# EAGLE design AS7265X.v02c (EAGLE 7.7.0)
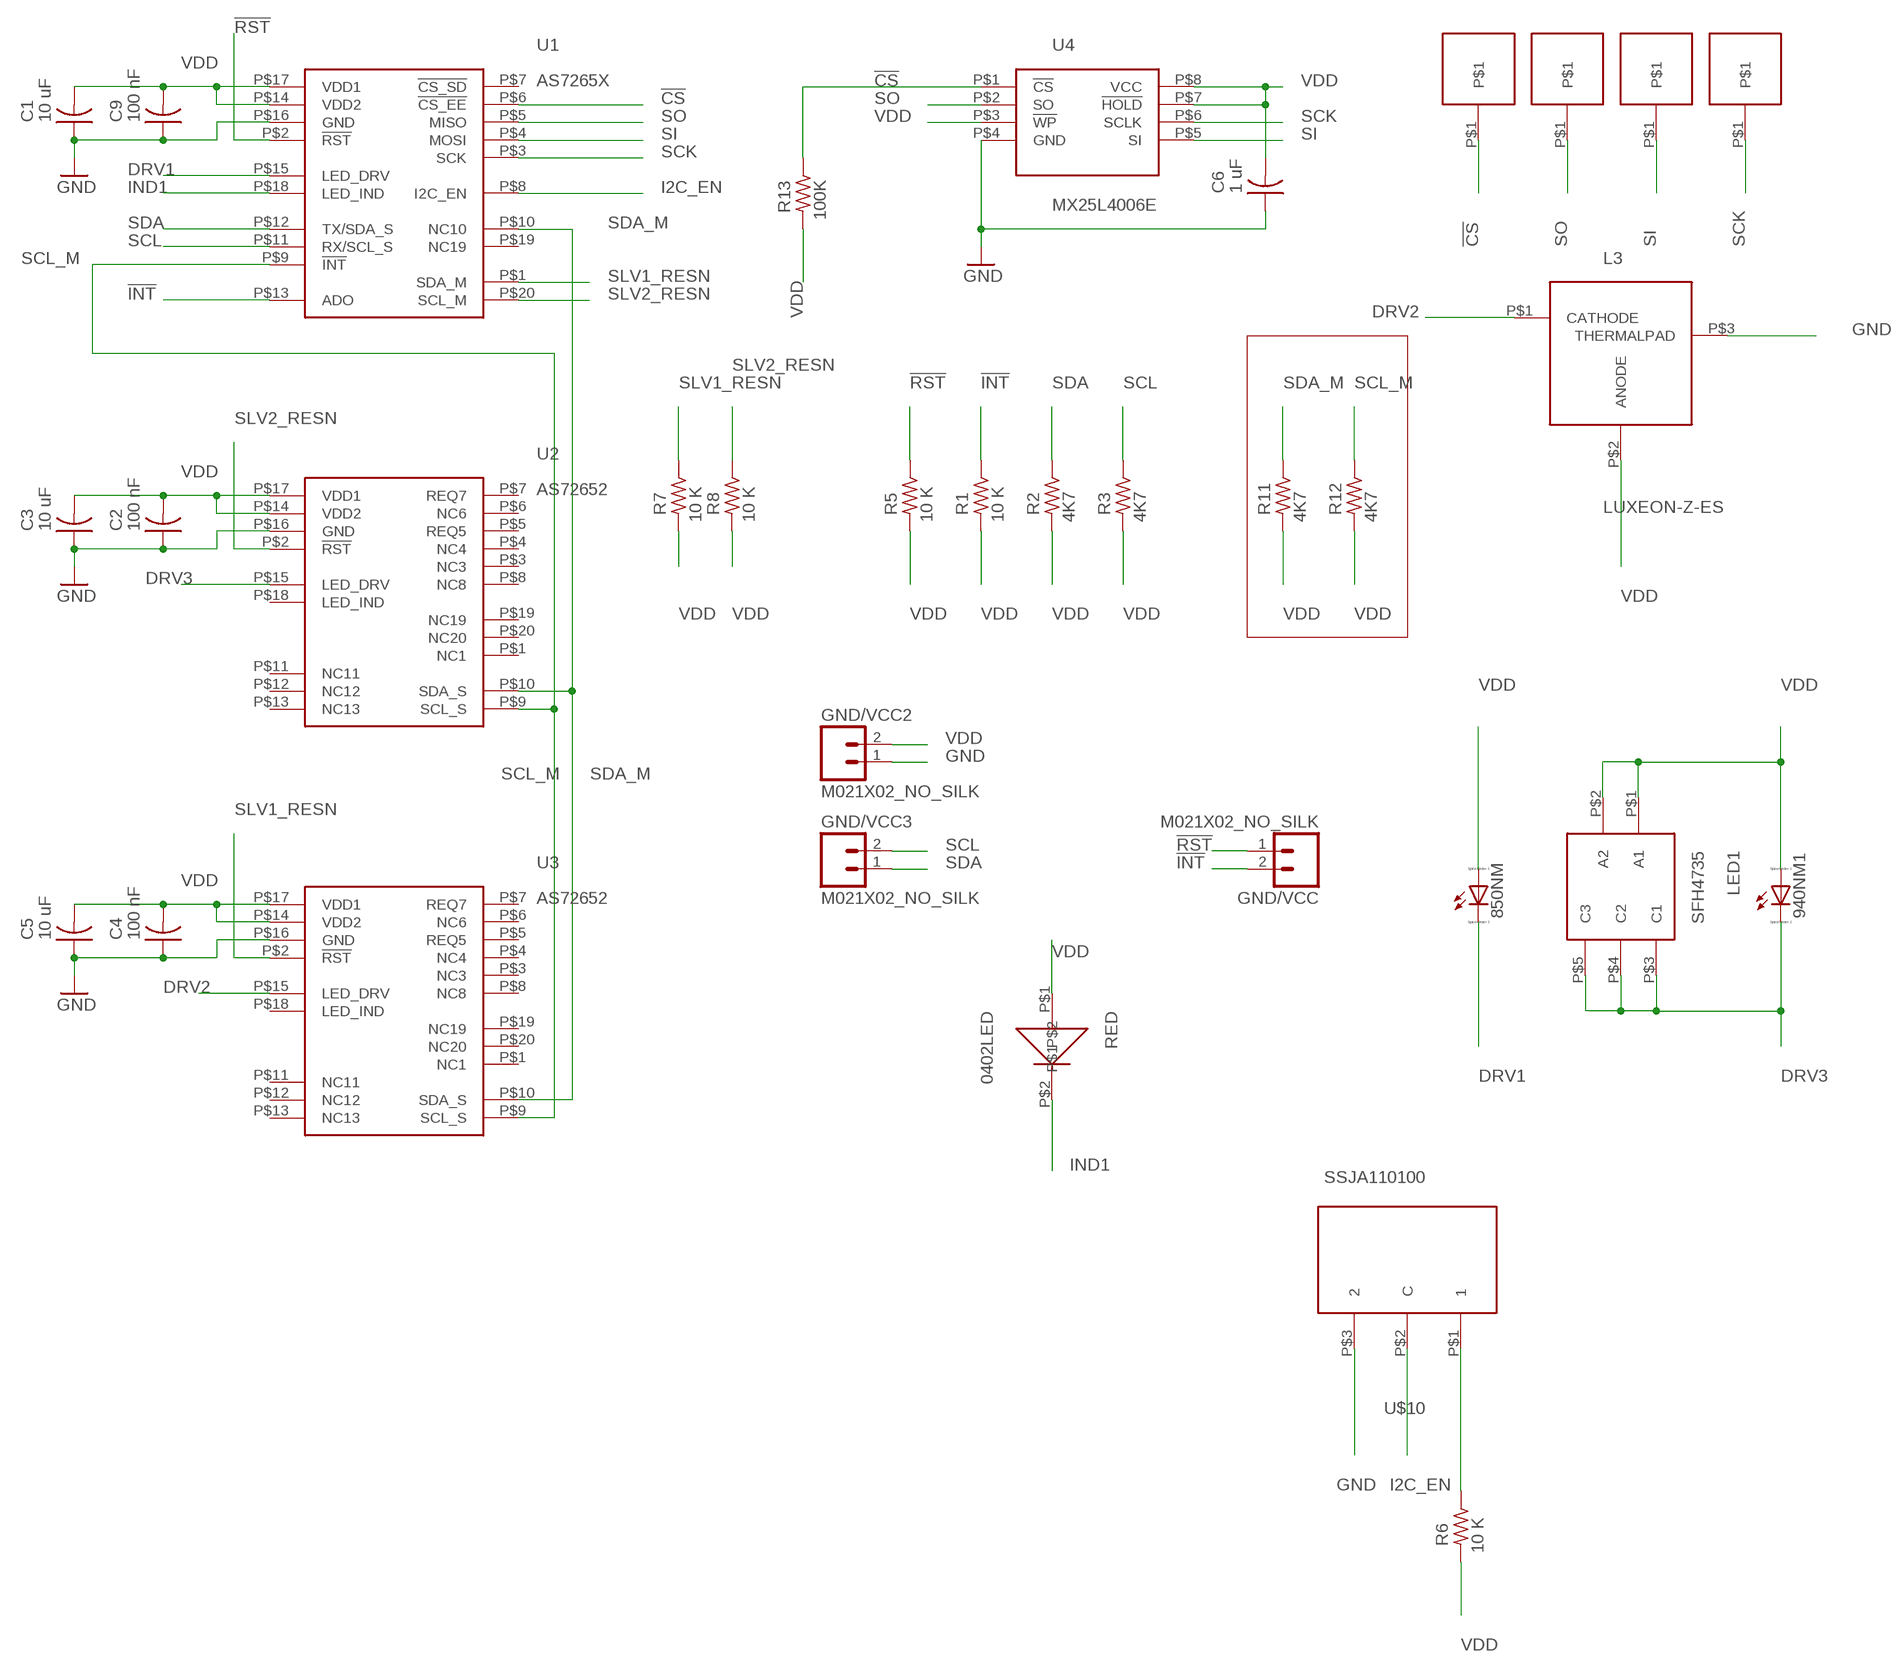
[diagram p0: schematic, sheet 1]

## Parts
850NM  LED_ESML0603  [LED_SML0603]
940NM1  LED_ESML0603  [LED_SML0603]
C1  10 uF  C-US  [C0402_B]
C2  100 nF  C-US  [C0402_B]
C3  10 uF  C-US  [C0402_B]
C4  100 nF  C-US  [C0402_B]
C5  10 uF  C-US  [C0402_B]
C6  1 uF  C-US  [C0402_B]
C9  100 nF  C-US  [C0402_B]
GND/VCC  M021X02_NO_SILK  [1X02_NO_SILK]
GND/VCC2  M021X02_NO_SILK  [1X02_NO_SILK]
GND/VCC3  M021X02_NO_SILK  [1X02_NO_SILK]
L3  LUXEON-Z-ES  [LUXEON-Z-ES]
LED1  SFH4735  [SFH4735]
R1  10 K  R-US_  [R0402_B]
R2  4K7  R-US_  [R0402_B]
R3  4K7  R-US_  [R0402_B]
R5  10 K  R-US_  [R0402_B]
R6  10 K  R-US_  [R0402_B]
R7  10 K  R-US_  [R0402_B]
R8  10 K  R-US_  [R0402_B]
R11  4K7  R-US_  [R0402_B]
R12  4K7  R-US_  [R0402_B]
R13  100K  R-US_  [R0402_B]
RED  0402LED  [0402LED]
U1  AS7265X  [AS7265X]
U2  AS72652  [AS7265X]
U3  AS72652  [AS7265X]
U4  MX25L4006E  [USON-8]
U$1  HN01  [HN01]
U$2  HN01  [HN01]
U$7  HN01  [HN01]
U$8  HN01  [HN01]
U$10  SSJA110100  [SSAJ110100]

## Nets
!CS: R13.1 U1.P$6(!CS_EE) U4.P$1(!CS) U$7.P$1
!INT: GND/VCC.2 R1.1 U1.P$13(ADO)
!RST: GND/VCC.1 R5.1 U1.P$2(!RST)
DRV1: 850NM.C U1.P$15(LED_DRV)
DRV2: L3.P$1(CATHODE) U3.P$15(LED_DRV)
DRV3: 940NM1.C LED1.P$3(C1) LED1.P$4(C2) LED1.P$5(C3) U2.P$15(LED_DRV)
GND: C1.1 C2.1 C3.1 C4.1 C5.1 C6.1 C9.1 GND/VCC2.1 L3.P$3(THERMALPAD) U1.P$16(GND) U2.P$16(GND) U3.P$16(GND) U4.P$4(GND) U$10.P$3
I2C_EN: U1.P$8(I2C_EN) U$10.P$2(C)
IND1: RED.P$2 U1.P$18(LED_IND)
N$1: R6.1 U$10.P$1
SCK: U1.P$3(SCK) U4.P$6(SCLK) U$2.P$1
SCL: GND/VCC3.2 R3.1 U1.P$11(RX/SCL_S)
SCL_M: R12.1 U1.P$9(!INT) U2.P$9(SCL_S) U3.P$9(SCL_S)
SDA: GND/VCC3.1 R2.1 U1.P$12(TX/SDA_S)
SDA_M: R11.1 U1.P$10(NC10) U2.P$10(SDA_S) U3.P$10(SDA_S)
SI: U1.P$4(MOSI) U4.P$5(SI) U$1.P$1
SLV1_RESN: R7.1 U1.P$1(SDA_M) U3.P$2(!RST)
SLV2_RESN: R8.1 U1.P$20(SCL_M) U2.P$2(!RST)
SO: U1.P$5(MISO) U4.P$2(SO) U$8.P$1
VDD: 850NM.A 940NM1.A C1.2 C2.2 C3.2 C4.2 C5.2 C6.2 C9.2 GND/VCC2.2 L3.P$2(ANODE) LED1.P$1(A1) LED1.P$2(A2) R1.2 R2.2 R3.2 R5.2 R6.2 R7.2 R8.2 R11.2 R12.2 R13.2 RED.P$1 U1.P$14(VDD2) U1.P$17(VDD1) U2.P$14(VDD2) U2.P$17(VDD1) U3.P$14(VDD2) U3.P$17(VDD1) U4.P$3(!WP) U4.P$7(!HOLD) U4.P$8(VCC)
Unconnected: U1.P$7(!CS_SD) U1.P$19(NC19) U2.P$1(NC1) U2.P$3(NC3) U2.P$4(NC4) U2.P$5(REQ5) U2.P$6(NC6) U2.P$7(REQ7) U2.P$8(NC8) U2.P$11(NC11) U2.P$12(NC12) U2.P$13(NC13) U2.P$18(LED_IND) U2.P$19(NC19) U2.P$20(NC20) U3.P$1(NC1) U3.P$3(NC3) U3.P$4(NC4) U3.P$5(REQ5) U3.P$6(NC6) U3.P$7(REQ7) U3.P$8(NC8) U3.P$11(NC11) U3.P$12(NC12) U3.P$13(NC13) U3.P$18(LED_IND) U3.P$19(NC19) U3.P$20(NC20)

## Library data of the parts
850NM 940NM1 = eagle-ltspice:LED_E: LED Source: http://www.osram.convergy.de Source: www.luxeon.com Source: www.kingbright.com; SPICEMODEL: NONE; SPICEPREFIX: D; SPICETYPE: diode
C1-C6 C9 = Spark:C-US: Capacitor
GND/VCC GND/VCC2 GND/VCC3 = SparkFun-Connectors:M02: Standard 2-pin 0.1" header. Use with - straight break away headers ( PRT-00116) - right angle break away headers (PRT-00553) - swiss pins (PRT-00743) - machine pins (PRT-00117) - female headers (PRT-00115) Molex polarized connector foot print use with: PRT-08233 with associated crimp pins and housings. 2.54_SCREWTERM for use with PRT-10571. 3.5mm Screw Terminal footprints for PRT-08084 5mm Screw Terminal footprints for use with PRT-08433
L3 = kris:LUXEON-Z-ES: Luxeon Z ES flash LED by Phillips
LED1 = kris:SFH4735: SFH4735 Broad-band iR led
R1-R3 R5-R8 R11-R13 = Spark:R-US_: 0402 Resistor
RED = kris:0402LED: 0402led
U1 = kris:AS7265X: AS7265X AMG Smart Spectral Sensor http://ams.com/eng/Products/Spectral-Sensing/Multi-spectral-Sensing/AS7265x
U2 U3 = kris:AS72652: AS72652/3
U4 = kris:MX25L4006E: uson-8 package for Macronix MX25L4006E 4 Mbit SPI Fash
U$1 U$2 U$7 U$8 = PWSONN6:HN01
U$10 = kris:SSJA110100: ALPS SSJA110100 SPDT slide switch with lugs

## Board
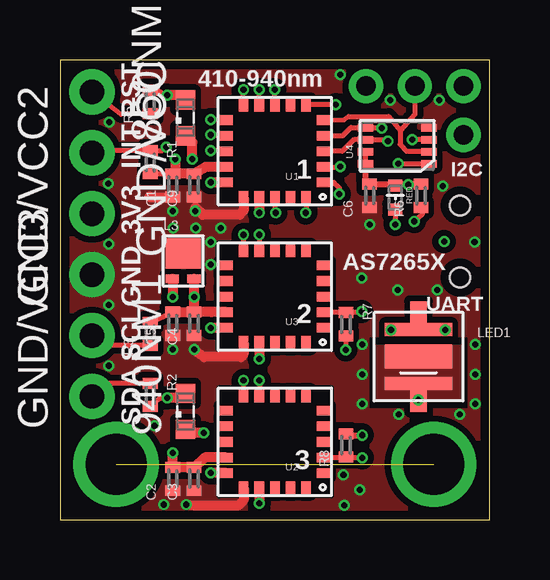
[diagram p1: board, top side]
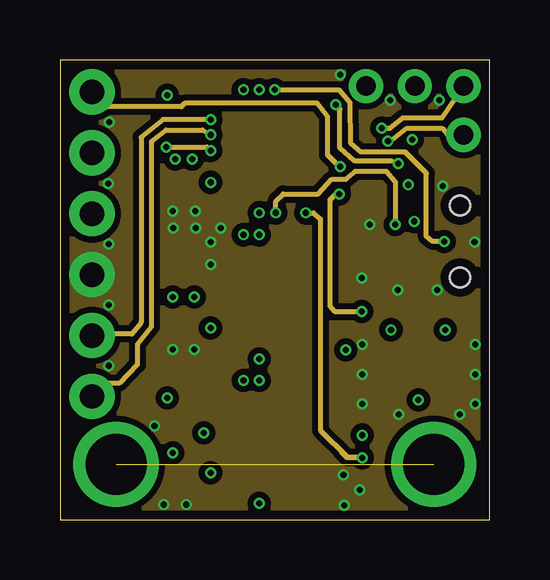
[diagram p2: board, inner layer Route2]
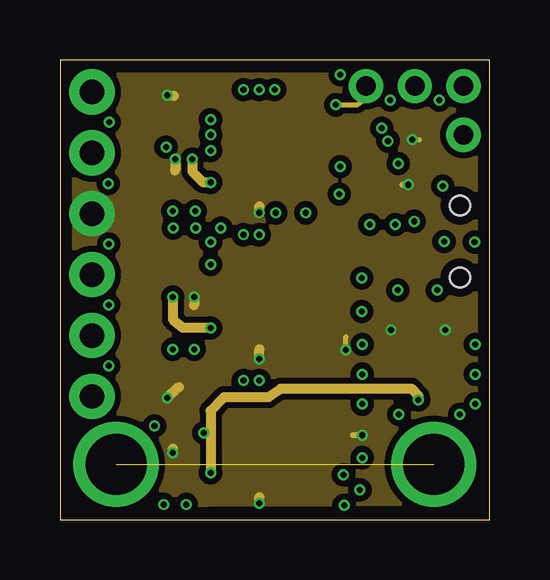
[diagram p3: board, inner layer Route15]
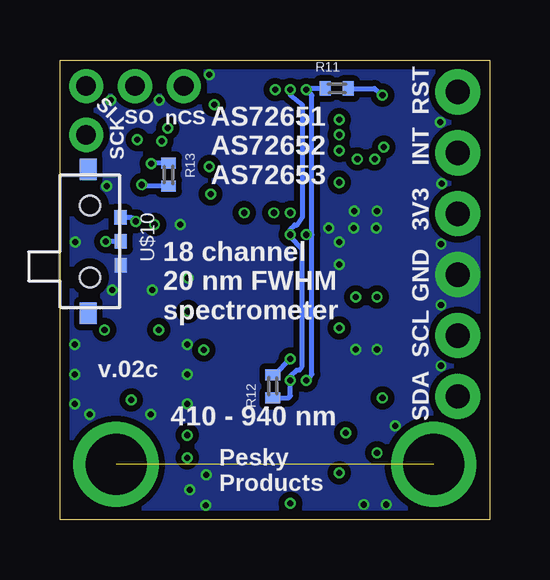
[diagram p4: board, bottom side, seen from below]

Size 17.91 x 19.18 mm. Coordinates in mm from the lower left corner, seen from the top.
Outline: 0,0 17.91,0 17.91,19.18 0,19.18 0,0
Copper layers (1*2*15*16): Top 0.035559375mm / dielectric 0.17018125mm / Route2 0.01778125mm / dielectric 47mil / Route15 0.01778125mm / dielectric 0.17018125mm / Bottom 0.035559375mm
Design rules "oshpark-4layer *": minimum track width 5mil, minimum drill 10mil, track to track 5mil, track to pad 5mil, pad to pad 5mil, via to via 5mil, smd to smd 5mil, copper to edge 15mil, drill to drill 6mil, minimum pad ring 4mil, minimum via ring 4mil, stop-mask expansion 2.5mil, vias tented up to drill 20mil, thermal gap 10mil

### Footprints (pad centres in the part's own frame; a part is rotated, then mirrored left to right if it is on the bottom)
LED_SML0603 = smd 0.8 x 0.8: A 0.75,0; C -0.75,0
C0402_B = smd 0.457 x 0.61: 1 -0.483,0; 2 0.483,0
1X02_NO_SILK = drill 1.016 pad 1.88: 1 0,0; 2 2.54,0
LUXEON-Z-ES = smd 0.55 x 0.35: P$1 -0.45,-0.745; P$2 0.45,-0.745 | smd 1.45 x 1.25: P$3 0,0.315
SFH4735 = smd 2.8 x 0.55: P$1 0,1.125; P$4 0,-1.125 | smd 0.7 x 0.9: P$2 0,1.85; P$5 0,-1.85 | smd 2.8 x 1: P$3 0,0
R0402_B = smd 0.457 x 0.61: 1 -0.483,0; 2 0.483,0
0402LED = smd 0.5 x 0.6: P$1 -0.5,0; P$2 0.5,0
AS7265X = smd 0.55 x 0.4: P$1 -2.025,1.3; P$2 -2.025,0.65; P$3 -2.025,0; P$4 -2.025,-0.65; P$5 -2.025,-1.3; P$11 2.025,-1.3; P$12 2.025,-0.65; P$13 2.025,0; P$14 2.025,0.65; P$15 2.025,1.3 | smd 0.4 x 0.55: P$6 -1.3,-1.925; P$7 -0.65,-1.925; P$8 0,-1.925; P$9 0.65,-1.925; P$10 1.3,-1.925; P$16 1.3,1.925; P$17 0.65,1.925; P$18 0,1.925; P$19 -0.65,1.925; P$20 -1.3,1.925
USON-8 = smd 0.3 x 0.65: P$1 -0.75,-1.325; P$2 -0.25,-1.325; P$3 0.25,-1.325; P$4 0.75,-1.325; P$5 0.75,1.325; P$6 0.25,1.325; P$7 -0.25,1.325; P$8 -0.75,1.325
HN01 = drill 0.813 pad 1.422: P$1 0,0
SSAJ110100 = smd 0.6 x 0.51: P$1 -1,1.28; P$2 0,1.285; P$3 1,1.285 | smd 0.9 x 0.7: P$4 3,-0.07; P$5 -3,-0.07 | hole 0.83: -1.5,0; 1.5,0

### Placement (x,y rotation side)
850NM  5.23,16.76 90 top
940NM1  5.23,4.52 90 top
C1  4.7,13.94 90 top
C2  4.7,1.7 90 top
C3  5.59,1.7 90 top
C4  5.59,8.18 90 top
C5  4.7,8.18 90 top
C6  12.9,13.51 90 top
C9  5.59,13.94 90 top
GND/VCC  1.33,17.84 270 top
GND/VCC2  1.33,10.22 90 top
GND/VCC3  1.33,5.14 90 top
L3  5.13,10.79 0 top
LED1  14.94,6.81 0 top
R1  3.76,14.91 270 top
R2  3.76,5.21 270 top
R3  3.76,7.75 90 top
R5  3.76,17.42 90 top
R6  15.04,13.51 90 top
R7  11.91,8.15 270 top
R8  11.91,3.1 90 top
R11  6.38,17.98 0 bottom
R12  9.04,5.56 90 bottom
R13  13.39,14.4 270 bottom
RED  13.97,13.44 270 top
U1  8.95,15.37 180 top
U2  8.95,3.25 180 top
U3  8.95,9.31 180 top
U4  14.05,15.6 90 top
U$1  16.81,18.08 0 top
U$2  16.81,16.05 0 top
U$7  12.75,18.08 0 top
U$8  14.78,18.08 0 top
U$10  16.66,11.61 270 bottom

### Tracks (layer width: path | path; a pad name or v marks a point on that pad's centre or on a via)
!CS  (via drill 0.25)
  Top 0.203: v14.1,14.86 15.15,14.86 U4.P$1 | v11.49,17.3 10.27,17.3 U1.P$6
  Route2 0.203: v14.1,14.86 14.07,14.88 13.97,14.88 13.82,14.96 12.27,14.96 11.66,15.49 11.66,17.14 v11.49,17.3
  Route15 0.203: U$7.P$1 12.75,17.55 12.37,17.3 11.6,17.3 v11.49,17.3
  Bottom 0.203: R13.1 14.07,14.88 v14.1,14.86
!INT  (via drill 0.25)
  Top 0.203: U1.P$13 6.9,15.39 v6.27,15.39 | GND/VCC.2 1.42,15.39 R1.1 4.24,15.39 v4.42,15.54
  Route2 0.203: v4.42,15.54 6.12,15.54 v6.27,15.39
!RST  (via drill 0.25)
  Top 0.203: U1.P$2 11.59,14.72 v11.68,14.73 | R5.1 2.54,16.92 GND/VCC.1
  Route2 0.203: v11.68,14.73 11.63,14.73 11.15,15.21 11.15,16.81 10.72,17.37 5.21,17.37 5.05,17.22 1.96,17.22 GND/VCC.1
DRV1  (via drill 0.25)
  Top 0.406: U1.P$15 6.38,14.07 v6.27,14.07 | v5.51,15.04 5.51,15.74 850NM.C
  Route15 0.406: v6.27,14.07 5.97,14.07 5.51,14.53 v5.51,15.04
DRV2  (via drill 0.25)
  Top 0.406: U3.P$15 6.28,8.01 v6.27,8 | v4.7,9.3 4.7,9.96 4.69,10.04 L3.P$1
  Route15 0.406: v6.27,8 5.13,8 4.7,8.36 v4.7,9.3
DRV3  (via drill 0.25)
  Top 0.406: U2.P$15 6.3,1.95 v6.27,1.96 | v5.99,3.62 5.38,3.62 940NM1.C | LED1.P$5 14.91,4.96 v14.94,5
  Route15 0.406: 6.27,3.61 6.27,4.55 6.83,5.11 8.69,5.11 9.2,5.46 14.66,5.46 14.94,5.16 v14.94,5 | 6.27,3.61 v6.27,1.96 | v5.99,3.62 6.27,3.61
  pour Top (isolate 0.254, no thermals): 13.16,7.29 16.71,7.29 16.71,4.93 13.16,4.93
GND  (via drill 0.25)
  Top 0.406: U1.P$16 7.65,12.89 7.49,12.72 5.94,12.72 5.64,13.03 v5.64,12.88 | U3.P$16 7.65,6.92 7.54,6.78 5.99,6.78 5.59,7.09 v5.59,7.11 | U2.P$16 7.65,0.82 7.42,0.58 5.59,0.58 v5.26,0.64 | 3.73,13.46 C1.1
  other vias: 11.84,0.61 4.7,12.88 3.94,3.91 15.8,17.5 15.95,13.92 13.77,17.5 11.68,18.57 11.81,1.88 12.5,1.24 4.32,0.64 4.7,7.11 4.72,12.17 5.66,12.17 6.27,10.64 6.27,11.58 6.71,12.17 2.03,8.97 12.57,10.08 2.03,6.43 2.03,11.51 2.01,14.02 2.06,16.59 17.3,4.83 16.66,4.39 12.6,7.32 12.6,6.07 12.6,4.83 14.12,4.39 17.3,7.32 17.3,6.07 17.27,11.58 15.72,9.58 14.07,9.58 12.9,12.32
  pour Bottom (isolate 0.254, no thermals): 0,19.18 17.91,19.18 17.91,0 0,0
  pour Route2 (isolate 0.254, no thermals): 0,19.18 17.91,19.18 17.91,0 0,0
  pour Top (isolate 0.254, no thermals): 17.91,4.65 17.12,4.65 17.12,7.72 12.75,7.72 12.75,4.55 17.91,4.55 17.91,0 0,0 0,19.18 17.91,19.18
I2C_EN  (via drill 0.25)
  Top 0.203: U1.P$8 8.95,17.39 v8.94,17.93
  Route2 0.203: v8.94,17.93 11.63,17.93 12.09,17.4 12.12,15.7 12.52,15.34 14.38,15.34 15.27,14.45 15.27,11.81 15.52,11.61 v16,11.61
  Bottom 0.203: U$10.P$2 v16,11.61
IND1  (via drill 0.25)
  Top 0.203: U1.P$18 8.95,12.89 v8.99,12.8 | RED.P$2 v13.97,12.32
  Route2 0.203: v8.99,12.8 8.99,13.28 9.3,13.59 10.77,13.59 11.33,14.2 11.91,14.2 12.29,14.53 13.61,14.53 13.97,14.1 v13.97,12.32
N$1  (via drill 0.25)
  Top 0.203: R6.1 14.94,13.11 15.09,13.16 15.09,12.72 v14.76,12.45
  Bottom 0.203: v14.76,12.45 14.93,12.6 U$10.P$1
N$4
  cutout Top: 6.6,17.63 11.3,17.63 11.3,13.13 6.63,13.13 6.63,17.58
N$8
  cutout Top: 6.65,11.56 11.28,11.56 11.28,7.09 6.6,7.09 6.6,11.53
N$9
  cutout Top: 6.63,5.51 11.3,5.51 11.3,0.99 6.63,0.99 6.63,5.49
N$11  (via drill 2.54)  (1 unrouted)
  other vias: 15.57,2.31 2.34,2.31
SCK  (via drill 0.25)
  Top 0.203: U1.P$3 11.76,15.37 12.24,15.85 U4.P$6 13.46,15.85 v13.66,15.8
  Route2 0.203: v13.66,15.8 13.84,15.85 14.45,16.33 15.93,16.33 16.15,16.05 U$2.P$1
SCL  (via drill 0.25)
  Top 0.203: R3.1 2.11,7.26 GND/VCC3.2 | U1.P$11 6.38,16.68 v6.27,16.69
  Route2 0.203: v6.27,16.69 4.29,16.69 3.38,15.95 3.38,8.23 3,7.75 2.11,7.75 GND/VCC3.2
SCL_M  (via drill 0.25)
  Top 0.203: v8.31,11.89 8.31,11.69 U3.P$9 | U2.P$9 8.35,5.48 v8.31,5.82 | U1.P$9 v8.31,17.93
  Bottom 0.203: R12.1 8.4,5.08 U2.P$9 8.3,5.76 v8.31,5.82 8.31,5.99 8.05,6.25 7.92,6.25 7.82,6.4 7.82,11.29 8.3,11.82 v8.3,11.88 v8.31,11.89 8.31,12.12 8.13,12.29 8.03,12.29 7.82,12.6 7.82,17.32 8.31,17.7 v8.31,17.93
SDA  (via drill 0.25)
  Top 0.203: R2.1 1.98,5.69 GND/VCC3.1 | U1.P$12 6.4,16.03 v6.27,16.05
  Route2 0.203: GND/VCC3.1 1.74,5.53 1.93,5.69 2.46,5.69 3.23,6.48 3.23,7.32 3.81,8.05 3.81,15.77 4.42,16.26 5.94,16.26 v6.27,16.05
SDA_M  (via drill 0.25)
  Top 0.203: v7.64,11.89 U3.P$10 | U2.P$10 7.65,5.68 v7.64,5.82 | U1.P$10 v7.64,17.93
  Bottom 0.203: v7.64,5.82 7.57,5.82 7.42,6.07 7.42,11.89 | R11.1 7.59,17.98 v7.64,17.93 7.42,17.7 7.42,11.89 | 7.42,11.89 7.42,11.88 v7.65,11.88 v7.64,11.89
SI  (via drill 0.25)
  Top 0.203: U1.P$4 11.78,16.02 12.12,16.36 12.68,16.36 U4.P$5 13.3,16.35 v13.41,16.33
  Route2 0.203: v13.41,16.33 13.74,16.33 14.28,16.76 15.93,16.76 U$1.P$1
SLV1_RESN  (via drill 0.25)
  Top 0.203: U3.P$2 11.89,8.66 | 11.89,8.66 R7.1 | 11.89,8.66 12.54,8.66 v12.57,8.69 | U1.P$1 11.41,14.07 11.61,13.87 11.63,13.82 v11.63,13.59
  Route2 0.203: v12.57,8.69 11.46,8.69 11.25,8.92 11.25,13.36 11.48,13.59 v11.63,13.59
SLV2_RESN  (via drill 0.25)
  Top 0.203: 11.96,2.6 12.69,2.6 v12.6,2.59 | U1.P$20 10.25,12.82 v10.24,12.8 | U2.P$2 11.95,2.6 R8.1
  Top 0.254: 11.96,2.6 R8.1
  Route2 0.203: 11.73,2.82 11.96,2.59 v12.6,2.59 12.68,2.62 11.96,2.62 10.85,3.73 10.85,12.55 10.57,12.8 v10.24,12.8
SO
  Top 0.203: U1.P$5 11.83,16.68 12.01,16.81 13.69,16.81 14.17,16.23 | 14.17,16.23 14.17,15.65 14.43,15.37 15.32,15.37 U4.P$2 | U$8.P$1 14.78,16.92 14.17,16.23
VDD  (via drill 0.25)
  Top 0.203: U4.P$3 15.4,15.85 v14.68,15.85 | U4.P$7 U4.P$8 | R3.2 C5.2 | R2.2 4.17,5.08 v4.47,5.08 | R7.2 v11.91,7.09 | R5.2 4.09,17.91 v4.47,17.7 | R1.2 C1.2 | 14.11,14 RED.P$1 | RED.P$1 13.85,13.99 | 12.98,13.87 C6.2 | 13.85,13.87 RED.P$1
  Top 0.254: U4.P$8 12.72,14.18 C6.2 13.91,14 RED.P$1 | 8.31,13.51 U1.P$17 | U3.P$17 | 6.96,2.59 U2.P$14 | R8.2 11.99,3.53 v12.6,3.53 | 14.11,14 14.48,14 v14.5,13.97 14.53,14 R6.2
  Top 0.406: U1.P$14 6.07,14.72 C9.2 C1.2 4.8,14.4 v4.8,15.04 | U3.P$14 6.32,8.66 C4.2 | C5.2 C4.2 | v4.7,2.79 C2.2 C3.2 6.04,2.6 U2.P$14 | 8.31,13.51 v8.31,12.8 | U3.P$17 v8.31,6.71 | U2.P$17 8.3,0.81 v8.31,0.69 | C4.2 v5.59,9.3 5.58,9.35 L3.P$2 | 850NM.A 4.84,17.72 v4.47,17.7 | 940NM1.A 4.89,5.08 v4.47,5.08 | LED1.P$2 LED1.P$1 15.89,7.93 v16.05,7.93
  Route15 0.203: v14.68,15.85 14.99,15.85 | v11.91,7.09 11.91,7.64
  Route15 0.254: v14.5,13.97 14.28,13.97 | v12.6,3.53 12.22,3.53
  Route15 0.406: v4.8,15.04 4.8,14.58 | v4.7,2.79 4.7,2.97 | v8.31,12.8 8.31,13.08 | v8.31,6.71 8.31,7.11 | v8.31,0.69 8.31,0.94 | v5.59,9.3 5.59,8.94 | v4.47,17.7 4.75,17.68 | v4.47,5.08 4.95,5.54
  Bottom 0.203: R12.2 8.97,6.04 v8.31,6.71 | 8.36,12.85 v8.31,12.8 | R11.2 4.8,17.98 v4.47,17.7 | R13.2 14.45,13.92 v14.5,13.97
  other vias: 13.79,7.92
  pour Route15 (isolate 0.254, no thermals): 0.64,18.54 17.27,18.54 17.27,0.69 0.64,0.64

### Text on the board
tPlace: RST | 410-940nm | INT | I2C | 3V3 | 1 | GND | AS7265X | SCL | UART | 2 | SDA | 3
bPlace: RST | SI | INT | nCS | SO | SCK | AS72651 / AS72652 / AS72653 | 3V3 | GND | SCL | 18 channel / 20 nm FWHM / spectrometer | SDA | v.02c | 410 - 940 nm | Pesky / Products